# EAGLE design Sensing (EAGLE 7.3.0)
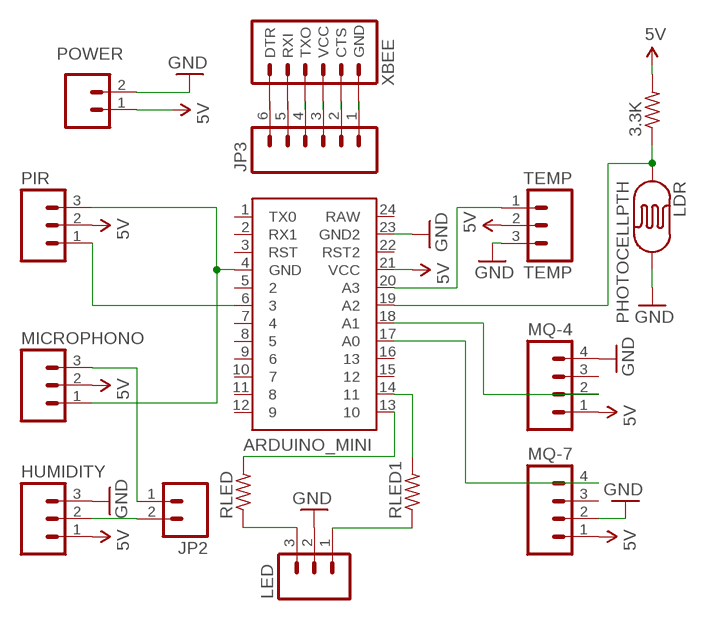
[diagram p0: schematic, sheet 1]

## Parts
3.3K  R-US_M0805  [M0805]
ARDUINO_MINI  ARDUINO_MINI  [ARDUINO_MINI]
HUMIDITY  HUMIDITY  M03PTH  [1X03]
JP2  M02PTH  [1X02]
JP3  M06SIP  [1X06]
LDR  PHOTOCELLPTH  [PHOTOCELL]
LED  M03PTH  [1X03]
MICROPHONO  M03PTH  [1X03]
MQ-4  M04PTH  [1X04]
MQ-7  M04PTH  [1X04]
PIR  M03PTH  [1X03]
POWER  M025MM  [SCREWTERMINAL-5MM-2]
RLED  R-US_M0805  [M0805]
RLED1  R-US_M0805  [M0805]
TEMP  TEMP  M031X03_NO_SILK  [1X03_NO_SILK]
XBEE  ARDUINO_SERIAL_PROGRAMPTH  [1X06]

## Nets
5V: 3.3K.2 ARDUINO_MINI.21(VCC) HUMIDITY.1 MICROPHONO.2 MQ-4.1 MQ-7.1 PIR.2 POWER.1 TEMP.2
EXTRA_SENS_OUT: ARDUINO_MINI.20(A3) TEMP.1
GND: ARDUINO_MINI.23(GND2) HUMIDITY.3 LDR.2 LED.2 MQ-4.4 MQ-7.2 POWER.2 TEMP.3
HUMIDITY: HUMIDITY.2 JP2.2
MQ4_(CH4)_SENS_OUT: ARDUINO_MINI.18(A1) MQ-4.2
MQ7_(CO)_SENS_OUT: ARDUINO_MINI.17(A0) MQ-7.4
N$1: LED.1 RLED1.1
N$2: LED.3 RLED.1
N$3: ARDUINO_MINI.6 PIR.1
N$4: ARDUINO_MINI.4(GND) MICROPHONO.1 PIR.3
N$6: JP3.6 XBEE.1(DTR)
N$7: JP3.5 XBEE.2(RXI)
N$8: JP3.4 XBEE.3(TXO)
N$9: JP3.3 XBEE.4(VCC)
N$10: JP3.2 XBEE.5(CTS)
N$11: JP3.1 XBEE.6(GND)
N$12: 3.3K.1 ARDUINO_MINI.19(A2) LDR.1
N$15: ARDUINO_MINI.14 RLED1.2
N$17: JP2.1 MICROPHONO.3
N$18: ARDUINO_MINI.13 RLED.2
Unconnected: ARDUINO_MINI.1(TX0) ARDUINO_MINI.2(RX1) ARDUINO_MINI.3(RST) ARDUINO_MINI.5 ARDUINO_MINI.7 ARDUINO_MINI.8 ARDUINO_MINI.9 ARDUINO_MINI.10 ARDUINO_MINI.11 ARDUINO_MINI.12 ARDUINO_MINI.15 ARDUINO_MINI.16 ARDUINO_MINI.22(RST2) ARDUINO_MINI.24(RAW) MQ-4.3 MQ-7.3

## Library data of the parts
3.3K RLED RLED1 = adafruit:R-US_: RESISTOR, American symbol
ARDUINO_MINI = SparkFun-Boards:ARDUINO_MINI: Arduino Pro Mini footprint
HUMIDITY LED MICROPHONO PIR TEMP = SparkFun:M03: Header 3 Standard 3-pin 0.1" header. Use with straight break away headers (SKU : PRT-00116), right angle break away headers (PRT-00553), swiss pins (PRT-00743), machine pins (PRT-00117), and female headers (PRT-00115). Molex polarized connector foot print use with SKU : PRT-08232 with associated crimp pins and housings.
JP2 POWER = SparkFun-Connectors:M02: Header 2 Standard 2-pin 0.1" header. Use with straight break away headers (SKU : PRT-00116), right angle break away headers (PRT-00553), swiss pins (PRT-00743), machine pins (PRT-00117), and female headers (PRT-00115). Molex polarized connector foot print use with SKU : PRT-08233 with associated crimp pins and housings.
JP3 = SparkFun-Connectors:M06: Header 6 Standard 6-pin 0.1" header. Use with straight break away headers (SKU : PRT-00116), right angle break away headers (PRT-00553), swiss pins (PRT-00743), machine pins (PRT-00117), and female headers (PRT-00115). Molex polarized connector foot print use with SKU : PRT-08094 with associated crimp pins and housings. NOTES ON THE VARIANTS LOCK and LOCK_LONGPADS... This footprint was designed to help hold the alignment of a through-hole component (i.e. 6-pin header) while soldering it into place. You may notice that each hole has been shifted either up or down by 0.005 of an inch from it's more standard position (which is a perfectly straight line). This slight alteration caused the pins (the squares in the middle) to touch the edges of the holes. Because they are alternating, it causes a "brace" to hold the component in place. 0.005 has proven to be the perfect amount of "off-center" position when using our standard breakaway headers. Although looks a little odd when you look at the bare footprint, once you have a header in there, the alteration is very hard to notice. Also, if you push a header all the way into place, it is covered up entirely on the bottom side. This idea of altering the position of holes to aid alignment will be further integrated into the Sparkfun Library for other footprints. It can help hold any component with 3 or more connection pins.
LDR = SparkFun:PHOTOCELL: Photocell Also known as a CdS photoresistor. This is a low cost way to detect light levels. Resistance decreases with more incoming light. SparkFun SKU: SEN-09088
MQ-4 MQ-7 = SparkFun-Connectors:M04: Header 4 Standard 4-pin 0.1" header. Use with straight break away headers (SKU : PRT-00116), right angle break away headers (PRT-00553), swiss pins (PRT-00743), machine pins (PRT-00117), and female headers (PRT-00115). Molex polarized connector foot print use with SKU : PRT-08231 with associated crimp pins and housings. 1MM SMD Version SKU: PRT-10208
XBEE = SparkFun-Connectors:ARDUINO_SERIAL_PROGRAM: FTDI connector footprints

## Board
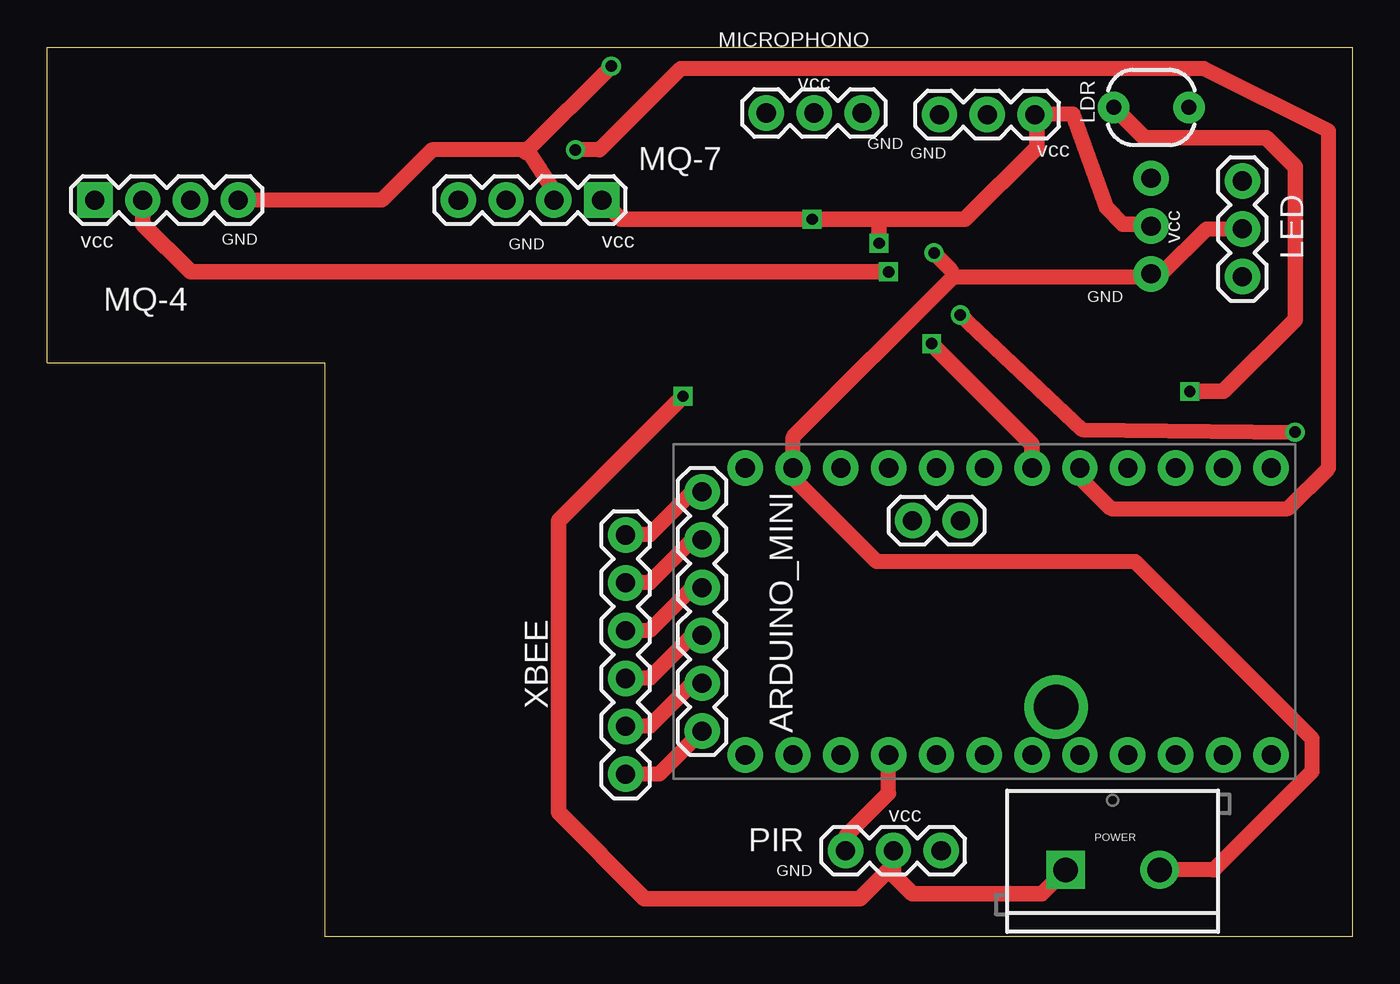
[diagram p1: board, top side]
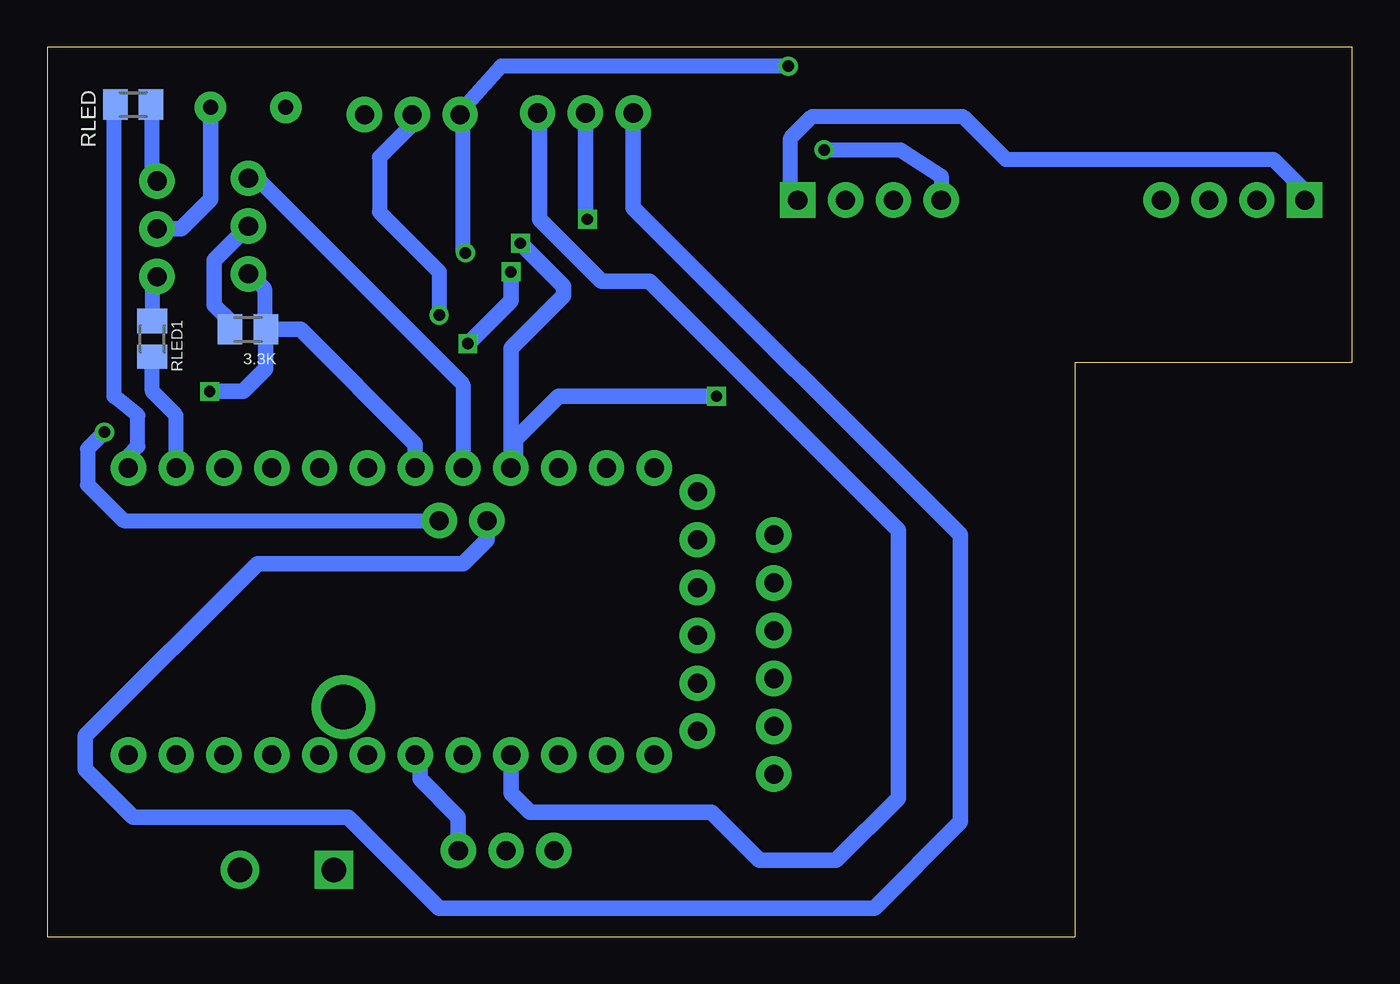
[diagram p2: board, bottom side, seen from below]

Size 69.34 x 47.24 mm. Coordinates in mm from the lower left corner, seen from the top.
Outline: 0,47.24 69.34,47.24 69.34,0 14.73,0 14.73,30.48 0,30.48 0,47.24
Copper layers (1*16): Top 0.035mm / dielectric 1.5mm / Bottom 0.035mm
Design rules "default": minimum track width 0.8mm, minimum drill 24mil, track to track 30mil, track to pad 30mil, pad to pad 30mil, via to via 30mil, smd to smd 30mil, copper to edge 40mil, drill to drill 20mil, minimum pad ring 10mil, minimum via ring 8mil, stop-mask expansion 4mil, vias tented up to drill 0mil, thermal gap 10mil

### Footprints (pad centres in the part's own frame; a part is rotated, then mirrored left to right if it is on the bottom)
M0805 = smd 1.3 x 1.6: 1 -0.95,0; 2 0.95,0
ARDUINO_MINI = drill 1.016 pad 1.88: 1 -7.62,12.7; 2 -7.62,10.16; 3 -7.62,7.62; 4 -7.62,5.08; 5 -7.62,2.54; 6 -7.62,0; 7 -7.62,-2.54; 8 -7.62,-5.08; 9 -7.62,-7.62; 10 -7.62,-10.16; 11 -7.62,-12.7; 12 -7.62,-15.24; 13 7.62,-15.24; 14 7.62,-12.7; 15 7.62,-10.16; 16 7.62,-7.62; 17 7.62,-5.08; 18 7.62,-2.54; 19 7.62,0; 20 7.62,2.54; 21 7.62,5.08; 22 7.62,7.62; 23 7.62,10.16; 24 7.62,12.7
1X03 = drill 1.016 pad 1.88: 1 0,0; 2 2.54,0; 3 5.08,0
1X02 = drill 1.016 pad 1.88: 1 0,0; 2 2.54,0
1X06 = drill 1.016 pad 1.88: 1 0,0; 2 2.54,0; 3 5.08,0; 4 7.62,0; 5 10.16,0; 6 12.7,0
PHOTOCELL = drill 0.8 pad 1.676: 1 -2,0; 2 2,0
1X04 = drill 1.016 pad 1.88 square: 1 0,0 | drill 1.016 pad 1.88: 2 2.54,0; 3 5.08,0; 4 7.62,0
SCREWTERMINAL-5MM-2 = drill 1.3 pad 2.032 square: 1 0,0 | drill 1.3 pad 2.032: 2 5,0
1X03_NO_SILK = drill 1.016 pad 1.88: 1 0,0; 2 2.54,0; 3 5.08,0

### Placement (x,y rotation side)
3.3K  58.67,32.26 180 bottom
ARDUINO_MINI  49.78,17.27 90 top
HUMIDITY  52.48,43.66 180 top
JP2  45.97,22.1 0 top
JP3  34.8,23.62 270 top
LDR  58.66,44.04 0 top
LED  63.5,35.05 90 top
MICROPHONO  43.28,43.74 180 top
MQ-4  2.54,39.12 0 top
MQ-7  29.46,39.12 180 top
PIR  47.5,4.57 180 top
POWER  54.1,3.56 0 top
RLED  64.77,44.2 180 bottom
RLED1  63.75,31.75 270 bottom
TEMP  58.65,40.28 270 top
XBEE  30.73,8.64 90 top

### Tracks (layer width: path | path; a pad name or v marks a point on that pad's centre or on a via)
5V  (via drill 0.6)
  Top 0.8: 54.48,43.69 52.58,43.69 HUMIDITY.1
  Top 0.813: MQ-7.1 30.48,38.1 v40.64,38.1 43.94,38.1 | 43.94,38.1 48.77,38.1 52.58,41.91 52.58,43.56 HUMIDITY.1 | POWER.1 52.83,2.29 45.97,2.29 44.96,3.3 PIR.2 44.96,3.81 43.18,2.03 31.75,2.03 27.18,6.6 27.18,22.1 v33.78,28.7 | v44.2,36.83 44.2,37.85 43.94,38.1 | 54.48,43.69 56.26,38.73 57.15,37.85 58.54,37.85 TEMP.2
  Bottom 0.8: MQ-4.1 2.54,39.62 4.19,41.27 18.41,41.27 20.7,43.56 28.7,43.56 29.84,42.42 29.84,39.5 MQ-7.1
  Bottom 0.813: MICROPHONO.2 40.74,38.2 v40.64,38.1 | v33.78,28.7 42.16,28.7 44.45,26.42 44.45,25.15 ARDUINO_MINI.21 44.7,31.24 41.91,34.04 41.91,34.54 v44.2,36.83 | 3.3K.2 59.62,32.7 60.45,33.53 60.45,35.93 TEMP.2
EXTRA_SENS_OUT
  Bottom 0.8: ARDUINO_MINI.20 47.24,29.34 58.17,40.26 58.55,40.26 TEMP.1
GND  (via drill 0.61)
  Top 0.8: LED.2 61.6,37.59 59.31,35.31 58.67,35.31 TEMP.3 58.29,35.05 48.13,35.05 | POWER.2 61.98,3.56 67.18,8.76 67.18,10.54 57.79,19.94 44.07,19.94 39.5,24.51 ARDUINO_MINI.23 39.62,26.54 48.13,35.05 | MQ-4.4 17.78,39.12 20.45,41.78 25.53,41.78 | 25.53,41.78 26.92,39.62 MQ-7.2 | 25.53,41.78 v29.97,46.23 | 25.4,41.66 25.53,41.78 | v47.12,36.32 48.01,35.43 48.13,35.05
  Bottom 0.8: 57.79,32.26 57.79,34.42 58.55,35.18 TEMP.3 | v29.97,46.23 45.21,46.23 47.5,43.69 47.37,43.69 HUMIDITY.3 47.24,43.31 47.24,36.45 v47.12,36.32
  Bottom 0.813: LDR.2 60.66,39.16 62.23,37.59 LED.2
HUMIDITY  (via drill 0.61)
  Top 0.8: v66.29,26.8 54.99,26.92 v48.51,33.02
  Bottom 0.8: JP2.2 65.28,22.1 67.18,24 67.18,25.91 v66.29,26.8 | v48.51,33.02 48.51,35.31 51.69,38.48 51.69,41.4 50.04,43.05 50.04,43.56 HUMIDITY.2
MQ4_(CH4)_SENS_OUT  (via drill 0.6)
  Top 0.813: ARDUINO_MINI.18 52.32,26.16 v46.99,31.5 | v44.7,35.31 7.62,35.31 5.08,37.85 MQ-4.2
  Bottom 0.813: v46.99,31.5 44.7,33.78 v44.7,35.31
MQ7_(CO)_SENS_OUT  (via drill 0.61)
  Top 0.8: ARDUINO_MINI.17 54.86,24.38 56.52,22.73 65.91,22.73 68.07,24.89 68.07,42.8 61.47,46.1 33.66,46.1 29.34,41.78 v28.07,41.78
  Bottom 0.8: MQ-7.4 21.84,40.39 24,41.78 v28.07,41.78
N$1
  Bottom 0.8: RLED1.1 63.75,34.8 LED.1
N$2
  Bottom 0.8: LED.3 63.75,40.39 63.75,44.2 RLED.1
N$3
  Bottom 0.813: PIR.1 47.5,6.35 49.53,8.38 49.53,9.4 ARDUINO_MINI.6
N$4
  Top 0.8: ARDUINO_MINI.4 44.7,7.62 42.42,5.33 PIR.3
  Bottom 0.813: ARDUINO_MINI.4 44.7,7.62 43.69,6.6 34.04,6.6 31.5,4.06 27.43,4.06 24.13,7.37 24.13,21.59 37.34,34.8 39.88,34.8 43.18,38.1 43.18,43.64 MICROPHONO.1
N$6
  Top 0.8: XBEE.1 32.51,8.64 JP3.6
N$7
  Top 0.8: XBEE.2 32,11.18 34.29,13.46 JP3.5
N$8
  Top 0.8: XBEE.3 32,13.72 34.29,16 JP3.4
N$9
  Top 0.8: XBEE.4 32,16.26 34.29,18.54 JP3.3
N$10
  Top 0.8: XBEE.5 32,18.8 34.29,21.08 JP3.2
N$11
  Top 0.8: XBEE.6 32,21.34 34.29,23.62 JP3.1
N$12  (via drill 0.6)
  Top 0.813: v60.71,28.96 62.48,28.96 66.29,32.77 66.29,40.89 64.77,42.42 58.28,42.42 LDR.1
  Bottom 0.813: ARDUINO_MINI.19 49.78,26.16 55.88,32.26 3.3K.1 57.72,30.16 58.93,28.96 v60.71,28.96
N$13  (via drill 2.36)
  other vias: 53.59,12.19
N$15
  Bottom 0.8: RLED1.2 63.75,28.96 62.48,27.69 ARDUINO_MINI.14
N$17
  Bottom 0.813: MICROPHONO.3 38.2,38.71 20.83,21.34 20.83,6.1 25.4,1.52 48.51,1.52 53.34,6.35 64.77,6.35 67.31,8.89 67.31,10.67 58.17,19.81 47.24,19.81 45.97,21.08 JP2.1
N$18
  Bottom 0.8: ARDUINO_MINI.13 65.02,25.53 64.52,26.04 64.52,27.69 65.79,28.7 65.79,44.2 RLED.2

### Text on the board
tNames: vcc | GND | GND | vcc | GND | GND | vcc | vcc | vcc | GND | vcc | GND